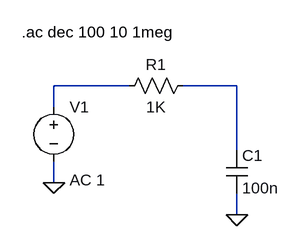
[diagram p0: schematic rc_lowpass.asc]
rc_lowpass.asc, the LTspice schematic file:
Version 4
SHEET 1 880 680
WIRE 176 224 64 224
WIRE 336 224 256 224
WIRE 64 256 64 224
WIRE 336 320 336 224
WIRE 64 368 64 336
WIRE 336 416 336 384
FLAG 64 368 0
FLAG 336 416 0
SYMBOL cap 320 320 R0
SYMATTR InstName C1
SYMATTR Value 100n
SYMBOL res 272 208 R90
WINDOW 0 0 56 VBottom 2
WINDOW 3 32 56 VTop 2
SYMATTR InstName R1
SYMATTR Value 1K
SYMBOL voltage 64 240 R0
WINDOW 123 24 124 Left 2
WINDOW 39 0 0 Left 0
SYMATTR InstName V1
SYMATTR Value ""
SYMATTR Value2 AC 1
TEXT 16 144 Left 2 !.ac dec 100 10 1meg

The netlist it stands for:
* rc_lowpass.asc
C1 N002 0 100n
R1 N002 N001 1K
V1 N001 0 AC 1
.ac dec 100 10 1meg
.backanno
.end